# EAGLE schematic PLCV2 (EAGLE 7.5.0)
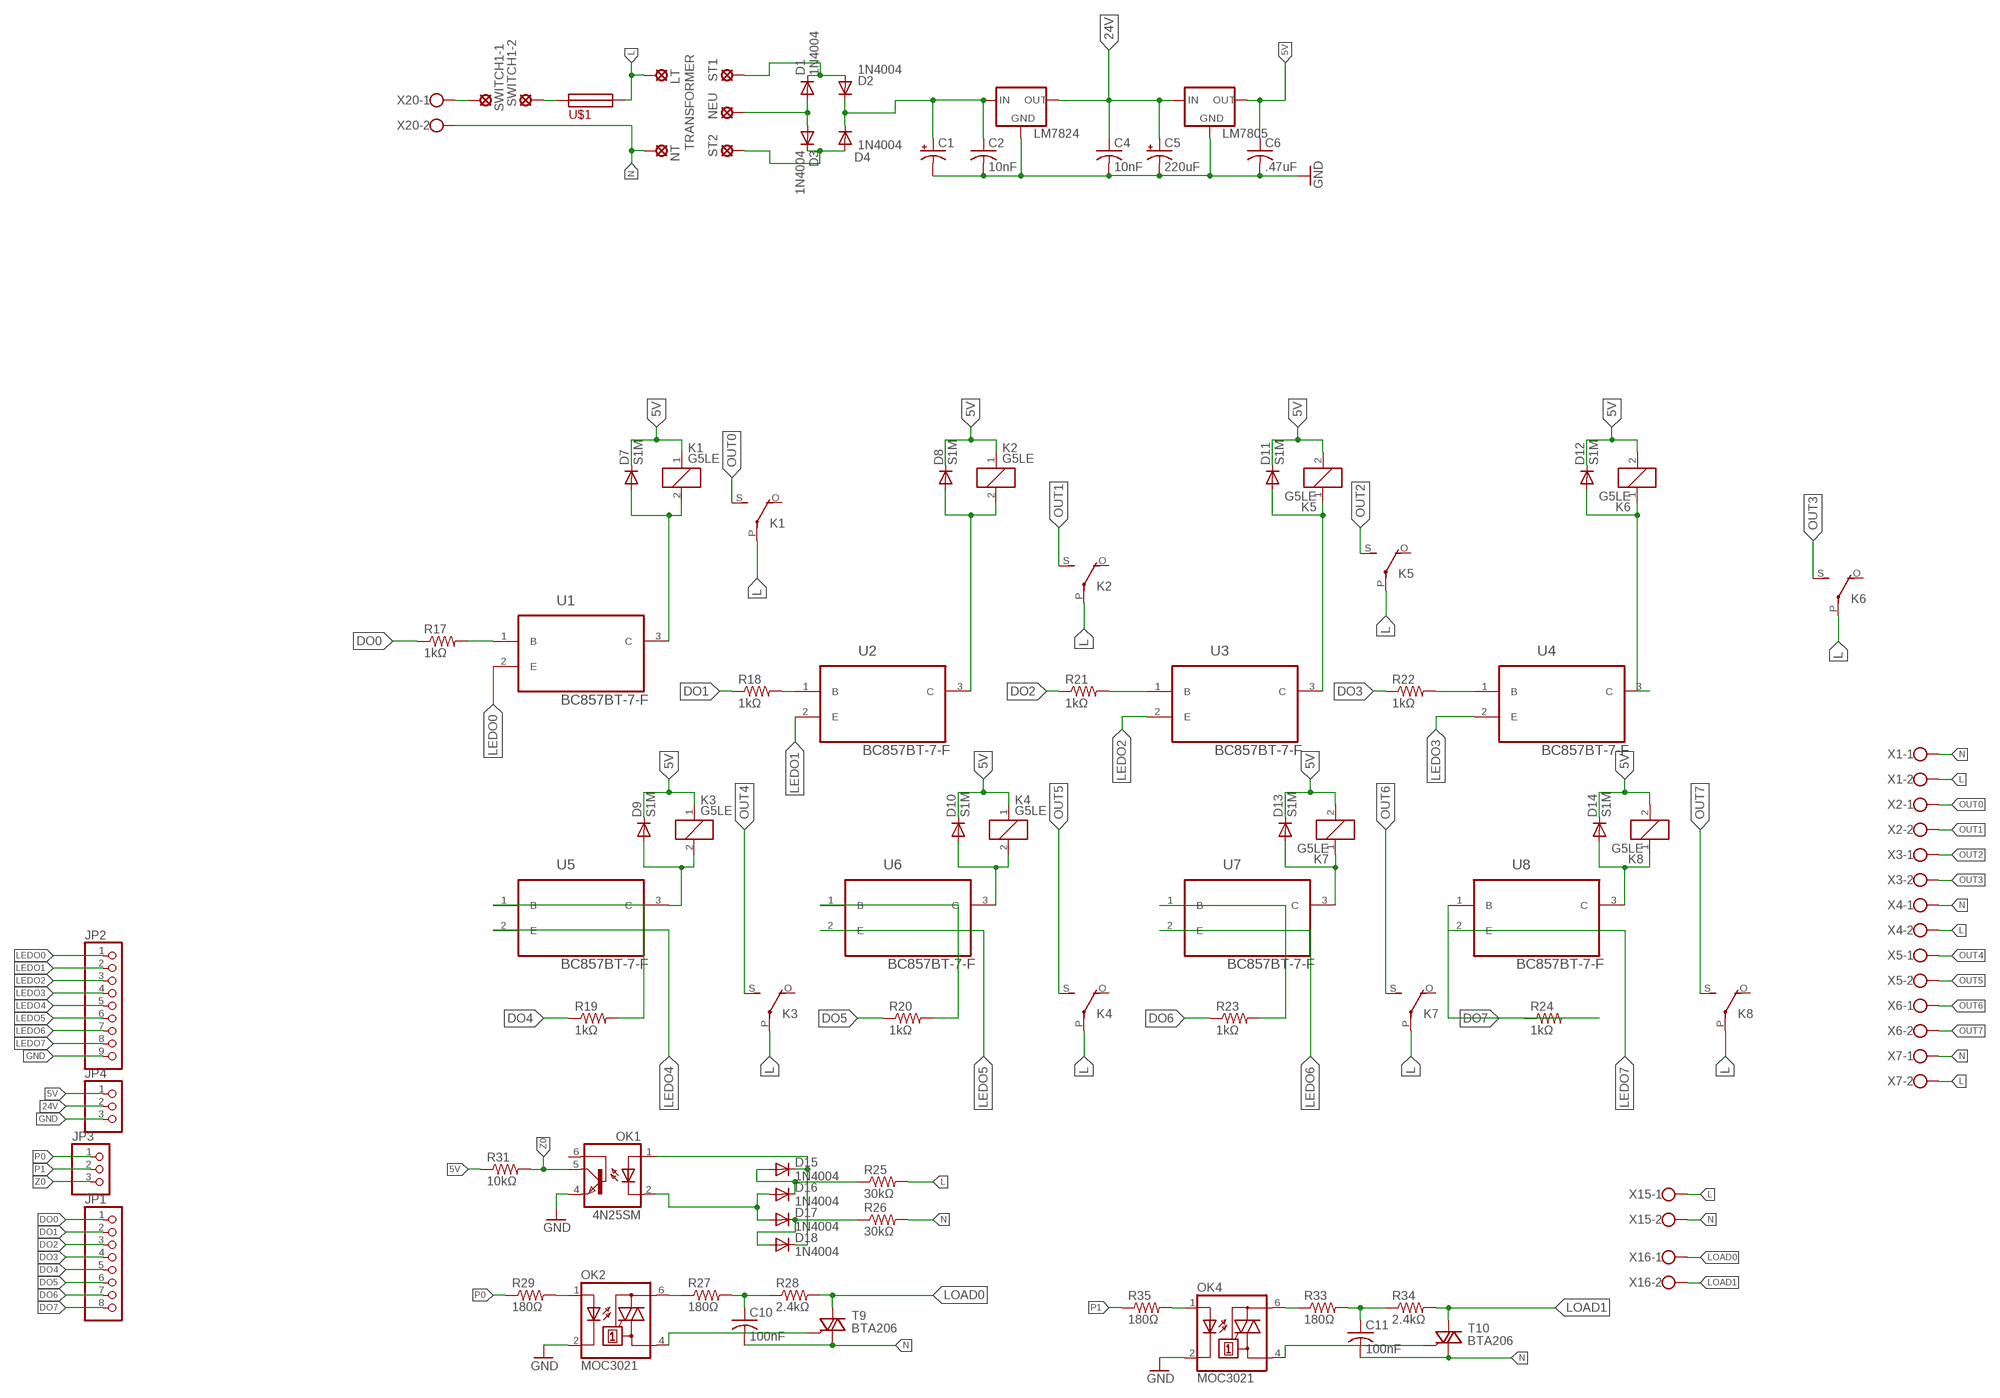
[diagram p0: schematic, sheet 1]

## Parts
C1  CAP_POLH13  [PANASONIC_H13]
C2  10nF  C-USC0402K  [C0402K]
C4  10nF  C-USC0402K  [C0402K]
C5  220uF  CPOL-USE2.5-6  [E2,5-6]
C6  .47uF  C-USC0603K  [C0603K]
C10  100nF  C-US075-042X103  [C075-042X103]
C11  100nF  C-US075-042X103  [C075-042X103]
D1  1N4004  [DO41-10]
D2  1N4004  [DO41-10]
D3  1N4004  [DO41-10]
D4  1N4004  [DO41-10]
D7  S1M  [SMA]
D8  S1M  [SMA]
D9  S1M  [SMA]
D10  S1M  [SMA]
D11  S1M  [SMA]
D12  S1M  [SMA]
D13  S1M  [SMA]
D14  S1M  [SMA]
D15  1N4004  [DO41-10]
D16  1N4004  [DO41-10]
D17  1N4004  [DO41-10]
D18  1N4004  [DO41-10]
JP1  PINHD-1X8  [1X08]
JP2  PINHD-1X9  [1X09]
JP3  PINHD-1X3  [1X03]
JP4  PINHD-1X3  [1X03]
K1  G5LE  [G5LE]
K2  G5LE  [G5LE]
K3  G5LE  [G5LE]
K4  G5LE  [G5LE]
K5  G5LE  [G5LE]
K6  G5LE  [G5LE]
K7  G5LE  [G5LE]
K8  G5LE  [G5LE]
LM7805  V_REG_78XX-TO-220  [TO-220-ALT]
LM7824  V_REG_78XX-TO-220  [TO-220-ALT]
LT  SE14  [SE14]
NEU  SE14  [SE14]
NT  SE14  [SE14]
OK1  4N25SM  [DIL6-SMD]
OK2  MOC3021  MOC3033S  [DIL6-SMD]
OK4  MOC3021  MOC3033S  [DIL6-SMD]
R17  1kΩ  R-US_R1206W  [R1206W]
R18  1kΩ  R-US_R1206W  [R1206W]
R19  1kΩ  R-US_R1206W  [R1206W]
R20  1kΩ  R-US_R1206W  [R1206W]
R21  1kΩ  R-US_R1206W  [R1206W]
R22  1kΩ  R-US_R1206W  [R1206W]
R23  1kΩ  R-US_R1206W  [R1206W]
R24  1kΩ  R-US_R1206W  [R1206W]
R25  30kΩ  R-US_M0805  [M0805]
R26  30kΩ  R-US_M0805  [M0805]
R27  180Ω  R-US_M0805  [M0805]
R28  2.4kΩ  R-US_M0805  [M0805]
R29  180Ω  R-US_M0805  [M0805]
R31  10kΩ  R-US_M0805  [M0805]
R33  180Ω  R-US_M0805  [M0805]
R34  2.4kΩ  R-US_M0805  [M0805]
R35  180Ω  R-US_M0805  [M0805]
ST1  SE14  [SE14]
ST2  SE14  [SE14]
SWITCH1-1  SE14  [SE14]
SWITCH1-2  SE14  [SE14]
T9  BTA206  BT136  [TO220AB]
T10  BTA206  BT136  [TO220AB]
U1  BC857BT-7-F  [SOT50P175X90-3N]
U2  BC857BT-7-F  [SOT50P175X90-3N]
U3  BC857BT-7-F  [SOT50P175X90-3N]
U4  BC857BT-7-F  [SOT50P175X90-3N]
U5  BC857BT-7-F  [SOT50P175X90-3N]
U6  BC857BT-7-F  [SOT50P175X90-3N]
U7  BC857BT-7-F  [SOT50P175X90-3N]
U8  BC857BT-7-F  [SOT50P175X90-3N]
U$1  LILFUSE  [LITTLEFUSE]
X1  W237-102  [W237-102]
X2  W237-102  [W237-102]
X3  W237-102  [W237-102]
X4  W237-102  [W237-102]
X5  W237-102  [W237-102]
X6  W237-102  [W237-102]
X7  W237-102  [W237-102]
X15  W237-102  [W237-102]
X16  W237-102  [W237-102]
X20  W237-102  [W237-102]

## Nets
5V: C6.1 D7.C D8.C D9.C D10.C D11.C D12.C D13.C D14.C JP4.1 K1.1 K2.1 K3.1 K4.1 K5.2 K6.2 K7.2 K8.2 LM7805.OUT R31.1
24V: C4.1 C5.+ JP4.2 LM7805.IN LM7824.OUT
DO0: JP1.1 R17.1
DO1: JP1.2 R18.1
DO2: JP1.3 R21.1
DO3: JP1.4 R22.1
DO4: JP1.5 R19.1
DO5: JP1.6 R20.1
DO6: JP1.7 R23.1
DO7: JP1.8 R24.1
GND: C1.- C2.2 C4.2 C5.- C6.2 JP2.9 JP4.3 LM7805.GND LM7824.GND OK1.4(EMI) OK2.2(C) OK4.2(C)
L: K1.P(2:P) K2.P(2:P) K3.P(2:P) K4.P(2:P) K5.P(2:P) K6.P(2:P) K7.P(2:P) K8.P(2:P) LT.MP R25.2 U$1.P$1 X1.2 X4.2 X7.2 X15.1
LEDO0: JP2.1 U1.2(E)
LEDO1: JP2.2 U2.2(E)
LEDO2: JP2.3 U3.2(E)
LEDO3: JP2.4 U4.2(E)
LEDO4: JP2.5 U5.2(E)
LEDO5: JP2.6 U6.2(E)
LEDO6: JP2.7 U7.2(E)
LEDO7: JP2.8 U8.2(E)
LOAD0: R28.2 T9.2(A2) X16.1
LOAD1: R34.2 T10.2(A2) X16.2
N: C10.2 C11.2 NT.MP R26.2 T9.1(A1) T10.1(A1) X1.1 X4.1 X7.1 X15.2 X20.2
N$1: D1.A D3.A NEU.MP
N$2: SWITCH1-1.MP X20.1
N$4: D3.C D4.A ST2.MP
N$5: D8.A K2.2 U2.3(C)
N$7: R18.2 U2.1(B)
N$9: D11.A K5.1 U3.3(C)
N$17: D7.A K1.2 U1.3(C)
N$18: D9.A K3.2 U5.3(C)
N$19: R17.2 U1.1(B)
N$20: R19.2 U5.1(B)
N$21: D10.A K4.2 U6.3(C)
N$22: R20.2 U6.1(B)
N$24: R21.2 U3.1(B)
N$25: D12.A K6.1 U4.3(C)
N$26: R22.2 U4.1(B)
N$27: D13.A K7.1 U7.3(C)
N$28: R23.2 U7.1(B)
N$29: D14.A K8.1 U8.3(C)
N$30: R24.2 U8.1(B)
N$31: D16.A D17.A OK1.2(C)
N$32: D15.C D18.C OK1.1(A)
N$33: D15.A D16.C R25.1
N$34: D17.C D18.A R26.1
N$35: OK2.6(A2) R27.1
N$38: C10.1 R27.2 R28.1
N$39: OK2.4(A1) T9.3(G)
N$42: OK2.1(A) R29.2
N$45: OK4.6(A2) R33.1
N$46: C11.1 R33.2 R34.1
N$47: OK4.4(A1) T10.3(G)
N$48: OK4.1(A) R35.2
N$57: SWITCH1-2.MP U$1.P$2
N$65: C1.+ C2.1 D2.C D4.C LM7824.IN
N$66: D1.C D2.A ST1.MP
OUT0: K1.S(2:S) X2.1
OUT1: K2.S(2:S) X2.2
OUT2: K5.S(2:S) X3.1
OUT3: K6.S(2:S) X3.2
OUT4: K3.S(2:S) X5.1
OUT5: K4.S(2:S) X5.2
OUT6: K7.S(2:S) X6.1
OUT7: K8.S(2:S) X6.2
P0: JP3.1 R29.1
P1: JP3.2 R35.1
Z0: JP3.3 OK1.5(COL) R31.2
Unconnected: K1.O(2:O) K2.O(2:O) K3.O(2:O) K4.O(2:O) K5.O(2:O) K6.O(2:O) K7.O(2:O) K8.O(2:O) OK1.6(BAS)

## Notes on the sheet
- TRANSFORMER

## Library data of the parts
C1 = SparkFun-Capacitors:CAP_POL: Capacitor Polarized These are standard SMD and PTH capacitors. Normally 10uF, 47uF, and 100uF in electrolytic and tantalum varieties. Always verify the external diameter of the through hole cap, it varies with capacity, voltage, and manufacturer. The EIA devices should be standard.
C2 C4 C6 C10 C11 = resistor:C-US: CAPACITOR, American symbol
C5 = resistor:CPOL-US: POLARIZED CAPACITOR, American symbol
D1-D4 D15-D18 = adafruit:1N4004: DIODE General purpose 1N400x type rectifier (With bigger pads) http://www.ladyada.net/library/pcb/eaglelibrary.html
D7-D14 = diode:S1M
JP1 = pinhead:PINHD-1X8: PIN HEADER
JP2 = pinhead:PINHD-1X9: PIN HEADER
JP3 JP4 = pinhead:PINHD-1X3: PIN HEADER
K1-K8 = relay:G5LE: RELAY 1 x switch, 10 A/120 V AC, 8 A/30 V DC, Omron; OC_FARNELL: unknown; OC_NEWARK: unknown
LM7805 LM7824 = SparkFun-PowerIC:V_REG_78XX: Voltage Regulator Standard 78xx regulator. IGO (Input Ground Output). Spark Fun Electronics SKU : COM-00107; PROD_ID: VREG-08450; SF_ID: COM-00107
LT NEU NT ST1 ST2 SWITCH1-1 SWITCH1-2 = solpad:SE14: SOLDER PAD E1553, drill 1,4mm, distributor Buerklin, 07F820
OK1 = optocoupler:4N*?M: General Purpose 6-Pin Phototransistor Optocouplers Source: http://www.fairchildsemi.com/ds/4N/4N35-M.pdf; MF: FAIRCHILD SEMICONDUCTOR; MPN: 4N25SM; OC_FARNELL: 1021152; OC_NEWARK: 34C2020
OK2 OK4 = optocoupler:MOC30*: 6-Pin DIP Zero-Cross Optoisolators Triac Driver Output (250/400 Volt Peak) Source: Data sheet <http://www.fairchildsemi.com/ds/MO/MOC3031M.pdf> The old path of data sheet not more available 2013-05-06.; MF: FAIRCHILD SEMICONDUCTOR; MPN: MOC3033S-M; OC_FARNELL: unknown; OC_NEWARK: 05C2878
R17-R29 R31 R33-R35 = resistor:R-US_: RESISTOR, American symbol
T9 T10 = triac:BT136: Triac BT136 series E sensitive gate Source: http://www.nxp.com/acrobat_download/datasheets/BT136_SERIES_E_2.pdf
U1-U8 = Diodes_Inc_By_element14_Batch_1:BC857BT-7-F: TRANSISTOR; MPN: BC857BT-7-F; OC_FARNELL: 1773650; OC_NEWARK: 51R6404; PACKAGE: SOT-523-3; SUPPLIER: Diodes Inc
U$1 = oliver:LILFUSE
X1-X7 X15 X16 X20 = con-wago-500:W237-102: WAGO SCREW CLAMP; MPN: 237-102; OC_FARNELL: unknown; OC_NEWARK: 70K9898